# Altium schematic sheet motorboard_simp_GEH.SchDoc
size A
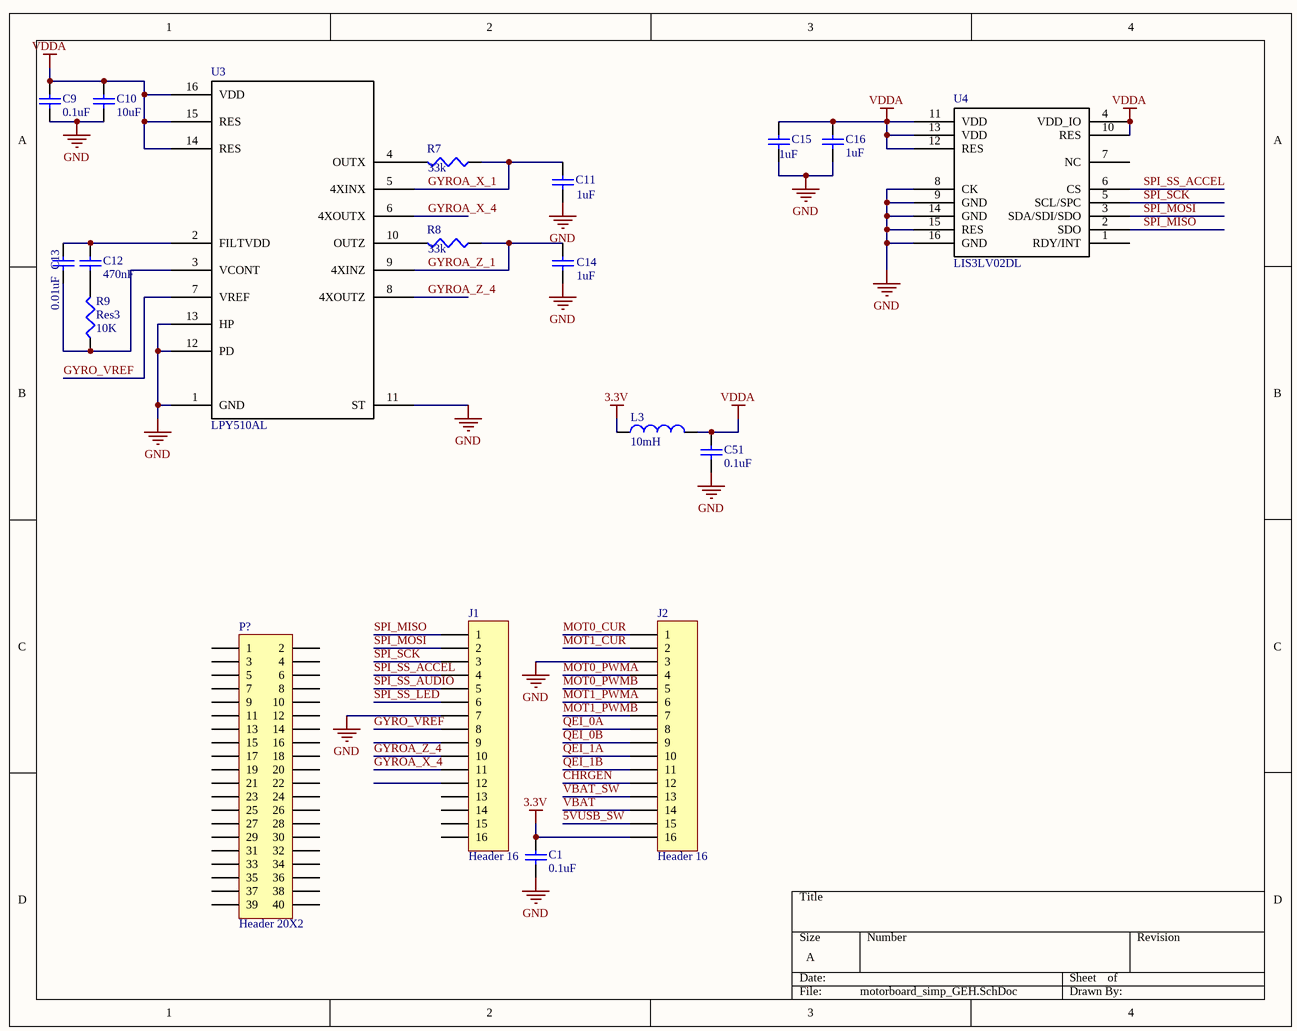
[diagram p0: motorboard_simp_GEH.SchDoc]

## Parts
C1  value 0.1uF  [CAPC3216L]  (hidden comment: Cap Semi)
C9  value 0.1uF  [CAPC1005L]  (hidden comment: Cap Semi)
C10  value 10uF  [CAPC1608L]  (hidden comment: Cap Semi)
C11  value 1uF  [CAPC1608L]  (hidden comment: Cap Semi)
C12  value 470nF  [CAPC1005L]  (hidden comment: Cap Semi)
C13  value 0.01uF  [CAPC1005L]  (hidden comment: Cap Semi)
C14  value 1uF  [CAPC1608L]  (hidden comment: Cap Semi)
C15  value 1uF  [CAPC1608L]  (hidden comment: Cap Semi)
C16  value 1uF  [CAPC1608L]  (hidden comment: Cap Semi)
C51  value 0.1uF  [CAPC1005L]  (hidden comment: Cap Semi)
J1  Header 16  [HDR1X16]
J2  Header 16  [HDR1X16]
L3  value 10mH  [INDC2012L]  (hidden comment: Inductor)
P?  Header 20X2  [HDR2X20]
R7  value 33k  [RESC1608L]  (hidden comment: Res3)
R8  value 33k  [RESC1608L]  (hidden comment: Res3)
R9  Res3  value 10K  [RESC1608L]
U3  LPY510AL  [LGA16]
U4  LIS3LV02DL  [LGA16 (4.4x7.5x1 mm)]

## Nets
3.3V: C1.2 J2.16 L3.2
GND: C1.1 C9.1 C10.1 C11.1 C14.1 C15.1 C16.1 C51.1 J1.7 J2.3 U3.1(GND) U3.11(ST) U3.12(PD) U3.13(HP) U4.8(CK) U4.9(GND) U4.14(GND) U4.15(RES) U4.16(GND)
VDDA: C9.2 C10.2 C15.2 C16.2 C51.2 L3.1 U3.14(RES) U3.15(RES) U3.16(VDD) U4.4(VDD_IO) U4.10(RES) U4.11(VDD) U4.12(RES) U4.13(VDD)
5VUSB_SW: J2.15
CHRGEN: J2.12
GYRO_VREF: J1.8 U3.7(VREF)
GYROA_X_1: C11.2 R7.1 U3.5(4XINX)
GYROA_X_4: J1.11 U3.6(4XOUTX)
GYROA_Z_1: C14.2 R8.1 U3.9(4XINZ)
GYROA_Z_4: J1.10 U3.8(4XOUTZ)
MOT0_CUR: J2.1
MOT0_PWMA: J2.4
MOT0_PWMB: J2.5
MOT1_CUR: J2.2
MOT1_PWMA: J2.6
MOT1_PWMB: J2.7
QEI_0A: J2.8
QEI_0B: J2.9
QEI_1A: J2.10
QEI_1B: J2.11
SPI_MISO: J1.1 U4.2(SDO)
SPI_MOSI: J1.2 U4.3(SDA/SDI/SDO)
SPI_SCK: J1.3 U4.5(SCL/SPC)
SPI_SS_ACCEL: J1.4 U4.6(CS)
SPI_SS_AUDIO: J1.5
SPI_SS_LED: J1.6
VBAT: J2.14
VBAT_SW: J2.13
NetC12_1: C12.1 R9.2
NetC12_2: C12.2 C13.2 U3.2(FILTVDD)
NetC13_1: C13.1 R9.1 U3.3(VCONT)
NetR7_2: R7.2 U3.4(OUTX)
NetR8_2: R8.2 U3.10(OUTZ)

Not connected (* = marked no-connect by the designer): J1 9 12 13 14 15 16; P? 1 2 3 4 5 6 7 8 9 10 11 12 13 14 15 16 17 18 19 20 21 22 23 24 25 26 27 28 29 30 31 32 33 34 35 36 37 38 39 40; U4 1(RDY/INT) 7(NC)

## Library data of the parts
C1 C9-C16 C51 = Cap Semi: Capacitor (Semiconductor SIM Model); Published: 8-Jun-2000; LatestRevisionDate: 29-May-2009; LatestRevisionNote: IPC-7351 Footprint Added.; PackageReference: C1206; Publisher: Altium Limited; PackageDescription: Chip Capacitor
J1 J2 = Header 16: Header, 16-Pin; LatestRevisionDate: 17-Jul-2002; LatestRevisionNote: Re-released for DXP Platform.; Publisher: Altium Limited
L3 = Inductor: Code_IEC: 1005; Published: 8-Jun-2000; LatestRevisionDate: 29-May-2009; LatestRevisionNote: IPC-7351 Footprint Added.; PackageReference: 0402-A; Publisher: Altium Limited; PackageDescription: Chip Inductor; Code_JEITA: 0402
P? = Header 20X2: Header, 20-Pin, Dual row; LatestRevisionDate: 17-Jul-2002; LatestRevisionNote: Re-released for DXP Platform.; Publisher: Altium Limited
R7-R9 = Res3: Resistor; Published: 8-Jun-2000; LatestRevisionDate: 29-May-2009; LatestRevisionNote: IPC-7351 Footprint Added.; PackageReference: J1-0603; Publisher: Altium Limited; PackageDescription: Chip Resistor